# EAGLE design 3level_2NX_interleaved_boost_converter (EAGLE 9.2.2)

## Sheet 1 of 2
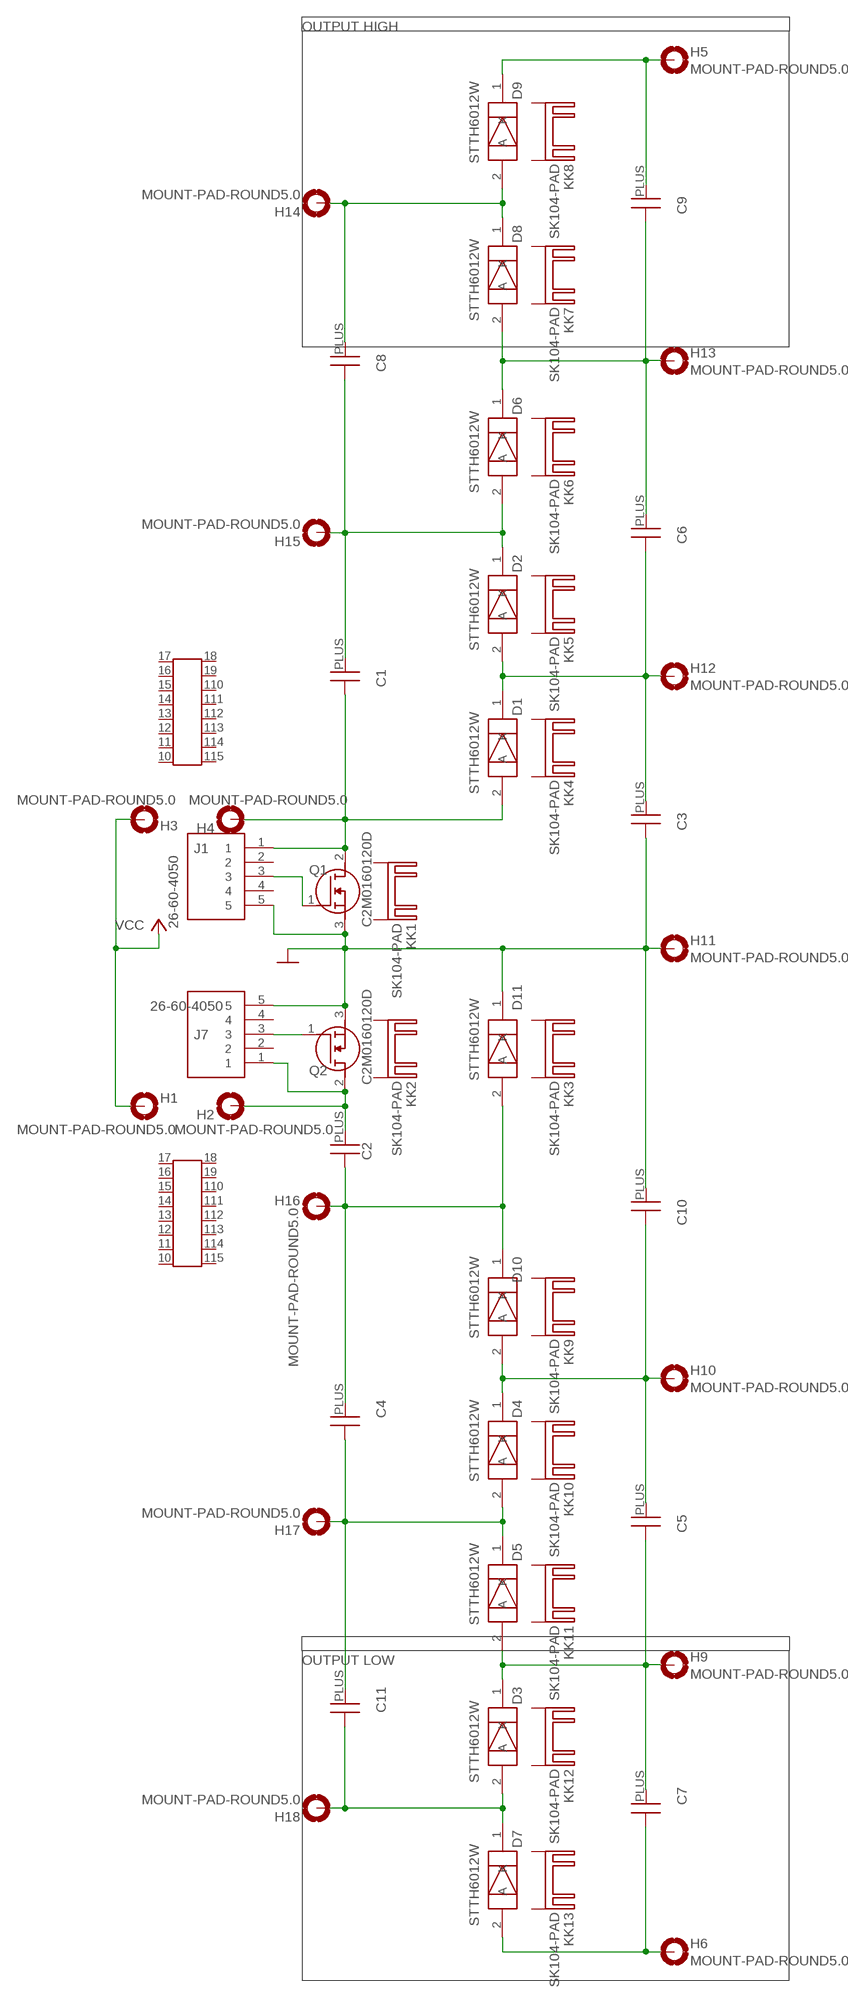
[diagram p0: schematic, sheet 1]

### Parts
C1  SANJEECAP  [ECA2WHG2R2]
C2  SANJEECAP  [ECA2WHG2R2]
C3  SANJEECAP  [ECA2WHG2R2]
C4  SANJEECAP  [ECA2WHG2R2]
C5  SANJEECAP  [ECA2WHG2R2]
C6  SANJEECAP  [ECA2WHG2R2]
C7  SANJEECAP  [ECA2WHG2R2]
C8  SANJEECAP  [ECA2WHG2R2]
C9  SANJEECAP  [ECA2WHG2R2]
C10  SANJEECAP  [ECA2WHG2R2]
C11  SANJEECAP  [ECA2WHG2R2]
D1  STTH6012W  [TO1090P515X1560X2445-2P]
D2  STTH6012W  [TO1090P515X1560X2445-2P]
D3  STTH6012W  [TO1090P515X1560X2445-2P]
D4  STTH6012W  [TO1090P515X1560X2445-2P]
D5  STTH6012W  [TO1090P515X1560X2445-2P]
D6  STTH6012W  [TO1090P515X1560X2445-2P]
D7  STTH6012W  [TO1090P515X1560X2445-2P]
D8  STTH6012W  [TO1090P515X1560X2445-2P]
D9  STTH6012W  [TO1090P515X1560X2445-2P]
D10  STTH6012W  [TO1090P515X1560X2445-2P]
D11  STTH6012W  [TO1090P515X1560X2445-2P]
H1  MOUNT-PAD-ROUND5.0  [5,0-PAD]
H2  MOUNT-PAD-ROUND5.0  [5,0-PAD]
H3  MOUNT-PAD-ROUND5.0  [5,0-PAD]
H4  MOUNT-PAD-ROUND5.0  [5,0-PAD]
H5  MOUNT-PAD-ROUND5.0  [5,0-PAD]
H6  MOUNT-PAD-ROUND5.0  [5,0-PAD]
H9  MOUNT-PAD-ROUND5.0  [5,0-PAD]
H10  MOUNT-PAD-ROUND5.0  [5,0-PAD]
H11  MOUNT-PAD-ROUND5.0  [5,0-PAD]
H12  MOUNT-PAD-ROUND5.0  [5,0-PAD]
H13  MOUNT-PAD-ROUND5.0  [5,0-PAD]
H14  MOUNT-PAD-ROUND5.0  [5,0-PAD]
H15  MOUNT-PAD-ROUND5.0  [5,0-PAD]
H16  MOUNT-PAD-ROUND5.0  [5,0-PAD]
H17  MOUNT-PAD-ROUND5.0  [5,0-PAD]
H18  MOUNT-PAD-ROUND5.0  [5,0-PAD]
J1  26-60-4050  [SHDR5W155P0X396_1X5_1966X1001X]
J7  26-60-4050  [SHDR5W155P0X396_1X5_1966X1001X]
KK1  SK104-PAD  [SK104-PAD]
KK2  SK104-PAD  [SK104-PAD]
KK3  SK104-PAD  [SK104-PAD]
KK4  SK104-PAD  [SK104-PAD]
KK5  SK104-PAD  [SK104-PAD]
KK6  SK104-PAD  [SK104-PAD]
KK7  SK104-PAD  [SK104-PAD]
KK8  SK104-PAD  [SK104-PAD]
KK9  SK104-PAD  [SK104-PAD]
KK10  SK104-PAD  [SK104-PAD]
KK11  SK104-PAD  [SK104-PAD]
KK12  SK104-PAD  [SK104-PAD]
KK13  SK104-PAD  [SK104-PAD]
Q1  C2M0160120D  [TO544P521X1594X2550-3P]
Q2  C2M0160120D  [TO544P521X1594X2550-3P]
U$1  JELL  [BOBBIN]
U$2  JELL  [BOBBIN]

### Nets
GND: C3.MINUS C10.PLUS D11.1(K) H11.B5(MOUNT) J1.5 J7.5 Q1.3(S) Q2.3(S) ; also sheet 2
N$1: C1.PLUS C8.MINUS D2.1(K) D6.2(A) H15.B5(MOUNT)
N$2: C1.MINUS D1.2(A) H4.B5(MOUNT) J1.1 Q1.2(D)
N$3: C3.PLUS C6.MINUS D1.1(K) D2.2(A) H12.B5(MOUNT)
N$4: C8.PLUS D8.1(K) D9.2(A) H14.B5(MOUNT)
N$5: C2.PLUS H2.B5(MOUNT) J7.1 Q2.2(D)
N$6: C9.PLUS D9.1(K) H5.B5(MOUNT)
N$7: C11.MINUS D3.2(A) D7.1(K) H18.B5(MOUNT)
N$8: C7.MINUS D7.2(A) H6.B5(MOUNT)
N$9: C2.MINUS C4.PLUS D10.1(K) D11.2(A) H16.B5(MOUNT)
N$10: C5.PLUS C10.MINUS D4.1(K) D10.2(A) H10.B5(MOUNT)
N$11: C6.PLUS C9.MINUS D6.1(K) D8.2(A) H13.B5(MOUNT)
N$12: J1.3 Q1.1(G)
N$13: J7.3 Q2.1(G)
N$17: C4.MINUS C11.PLUS D4.2(A) D5.1(K) H17.B5(MOUNT)
N$18: C5.MINUS C7.PLUS D3.1(K) D5.2(A) H9.B5(MOUNT)
VCC: H1.B5(MOUNT) H3.B5(MOUNT) ; also sheet 2
Unconnected: J1.2 J1.4 J7.2 J7.4 KK1.K1(K) KK1.K2(K) KK2.K1(K) KK2.K2(K) KK3.K1(K) KK3.K2(K) KK4.K1(K) KK4.K2(K) KK5.K1(K) KK5.K2(K) KK6.K1(K) KK6.K2(K) KK7.K1(K) KK7.K2(K) KK8.K1(K) KK8.K2(K) KK9.K1(K) KK9.K2(K) KK10.K1(K) KK10.K2(K) KK11.K1(K) KK11.K2(K) KK12.K1(K) KK12.K2(K) KK13.K1(K) KK13.K2(K) U$1.10 U$1.11 U$1.12 U$1.13 U$1.14 U$1.15 U$1.16 U$1.17 U$1.18 U$1.19 U$1.110 U$1.111 U$1.112 U$1.113 U$1.114 U$1.115 U$2.10 U$2.11 U$2.12 U$2.13 U$2.14 U$2.15 U$2.16 U$2.17 U$2.18 U$2.19 U$2.110 U$2.111 U$2.112 U$2.113 U$2.114 U$2.115

### Notes on the sheet
- OUTPUT HIGH
- OUTPUT LOW

## Sheet 2 of 2
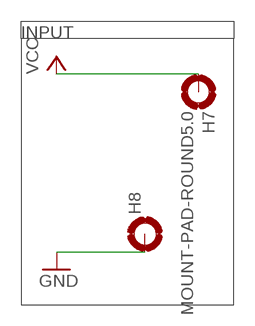
[diagram p1: schematic, sheet 2]

### Parts
H7  MOUNT-PAD-ROUND5.0  [5,0-PAD]
H8  MOUNT-PAD-ROUND5.0  [5,0-PAD]

### Nets
GND: H8.B5(MOUNT) ; also sheet 1
VCC: H7.B5(MOUNT) ; also sheet 1

### Notes on the sheet
- INPUT

## Library data of the parts
C1-C11 = placeholders:SANJEECAP
D1-D11 = SamacSys_Parts:STTH6012W: STTH6012W, Fast Recovery Rectifier Diode, Switching 60A max, 1200V 125ns, 2-Pin, DO-247 Source: Datasheet <http://www.st.com/web/en/resource/technical/document/datasheet/CD00096472.pdf>; ALLIED_NUMBER: 70014108; ALLIED_PRICE-STOCK: http://www.alliedelec.com/stmicroelectronics-stth6012w/70014108/; ARROW_PART_NUMBER: STTH6012W; ARROW_PRICE-STOCK: https://www.arrow.com/en/products/stth6012w/stmicroelectronics; DESCRIPTION: STTH6012W, Fast Recovery Rectifier Diode, Switching 60A max, 1200V 125ns, 2-Pin, DO-247; HEIGHT: 5.15mm; MANUFACTURER_NAME: STMicroelectronics; MANUFACTURER_PART_NUMBER: STTH6012W; RS_PART_NUMBER: 6870818; RS_PRICE-STOCK: http://uk.rs-online.com/web/p/rectifier-schottky-diodes/6870818/?source=DS
H1-H18 = holes:MOUNT-PAD-ROUND: MOUNTING PAD, round
J1 J7 = SamacSys_Parts:26-60-4050: Molex KK 396 Series, Series Number 41791, 3.96mm Pitch 5 Way 1 Row Straight PCB Header, Solder Termination, 7A Source: Datasheet <https://componentsearchengine.com/Datasheets/1/26-60-4050.pdf>; DESCRIPTION: Molex KK 396 Series, Series Number 41791, 3.96mm Pitch 5 Way 1 Row Straight PCB Header, Solder Termination, 7A; HEIGHT: 14.78mm; MANUFACTURER_NAME: Molex; MANUFACTURER_PART_NUMBER: 26-60-4050; MOUSER_PART_NUMBER: 538-26-60-4050
KK1-KK13 = heatsink:SK104-PAD: HEATSINK manufacturer Fischer/distributor Buerklin
Q1 = SamacSys_Parts:C2M0160120D: Wolfspeed C2M0160120D N-channel SiC MOSFET Transistor, 19 A, 1200 V, 3-Pin TO-247 Source: Datasheet <http://www.wolfspeed.com/media/downloads/169/C2M0160120D.pdf>; ARROW_PART_NUMBER: C2M0160120D; ARROW_PRICE-STOCK: http://uk.rs-online.com/web/p/products/1629709; DESCRIPTION: Wolfspeed C2M0160120D N-channel SiC MOSFET Transistor, 19 A, 1200 V, 3-Pin TO-247; HEIGHT: 5.21mm; MANUFACTURER_NAME: Wolfspeed; MANUFACTURER_PART_NUMBER: C2M0160120D; RS_PART_NUMBER: 1629709; RS_PRICE-STOCK: http://uk.rs-online.com/web/p/products/1629709
Q2 = SamacSys_Parts:C2M0160120D: Wolfspeed C2M0160120D N-channel SiC MOSFET Transistor, 19 A, 1200 V, 3-Pin TO-247 Source: Datasheet <http://www.wolfspeed.com/media/downloads/169/C2M0160120D.pdf>; ARROW_PART_NUMBER: C2M0160120D; ARROW_PRICE-STOCK: http://uk.rs-online.com/web/p/products/1629709; DESCRIPTION: Wolfspeed C2M0160120D N-channel SiC MOSFET Transistor, 19 A, 1200 V, 3-Pin TO-247; HEIGHT: 5.21mm; MANUFACTURER_NAME: Wolfspeed; MANUFACTURER_PART_NUMBER: C2M0160120D; RS_PART_NUMBER: 1629709; RS_PRICE-STOCK: http://uk.rs-online.com/web/p/products/1629709; SPICEPREFIX: Q
U$1 U$2 = placeholders:JELL

## Board
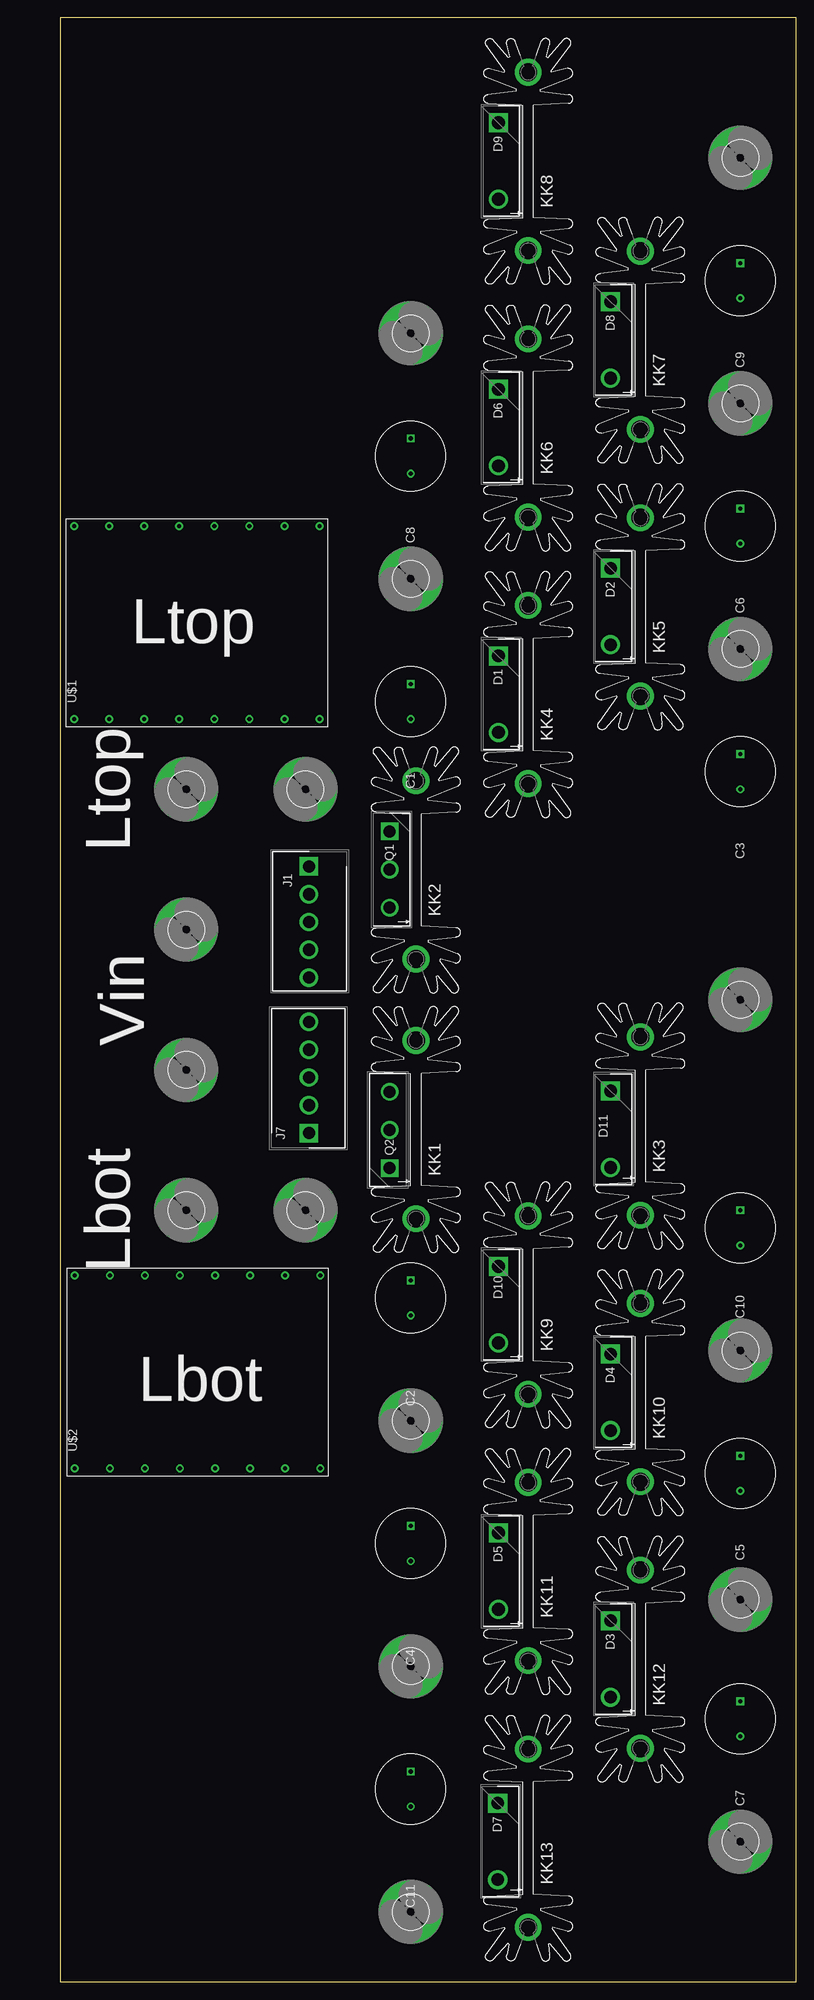
[diagram p2: board, top side]
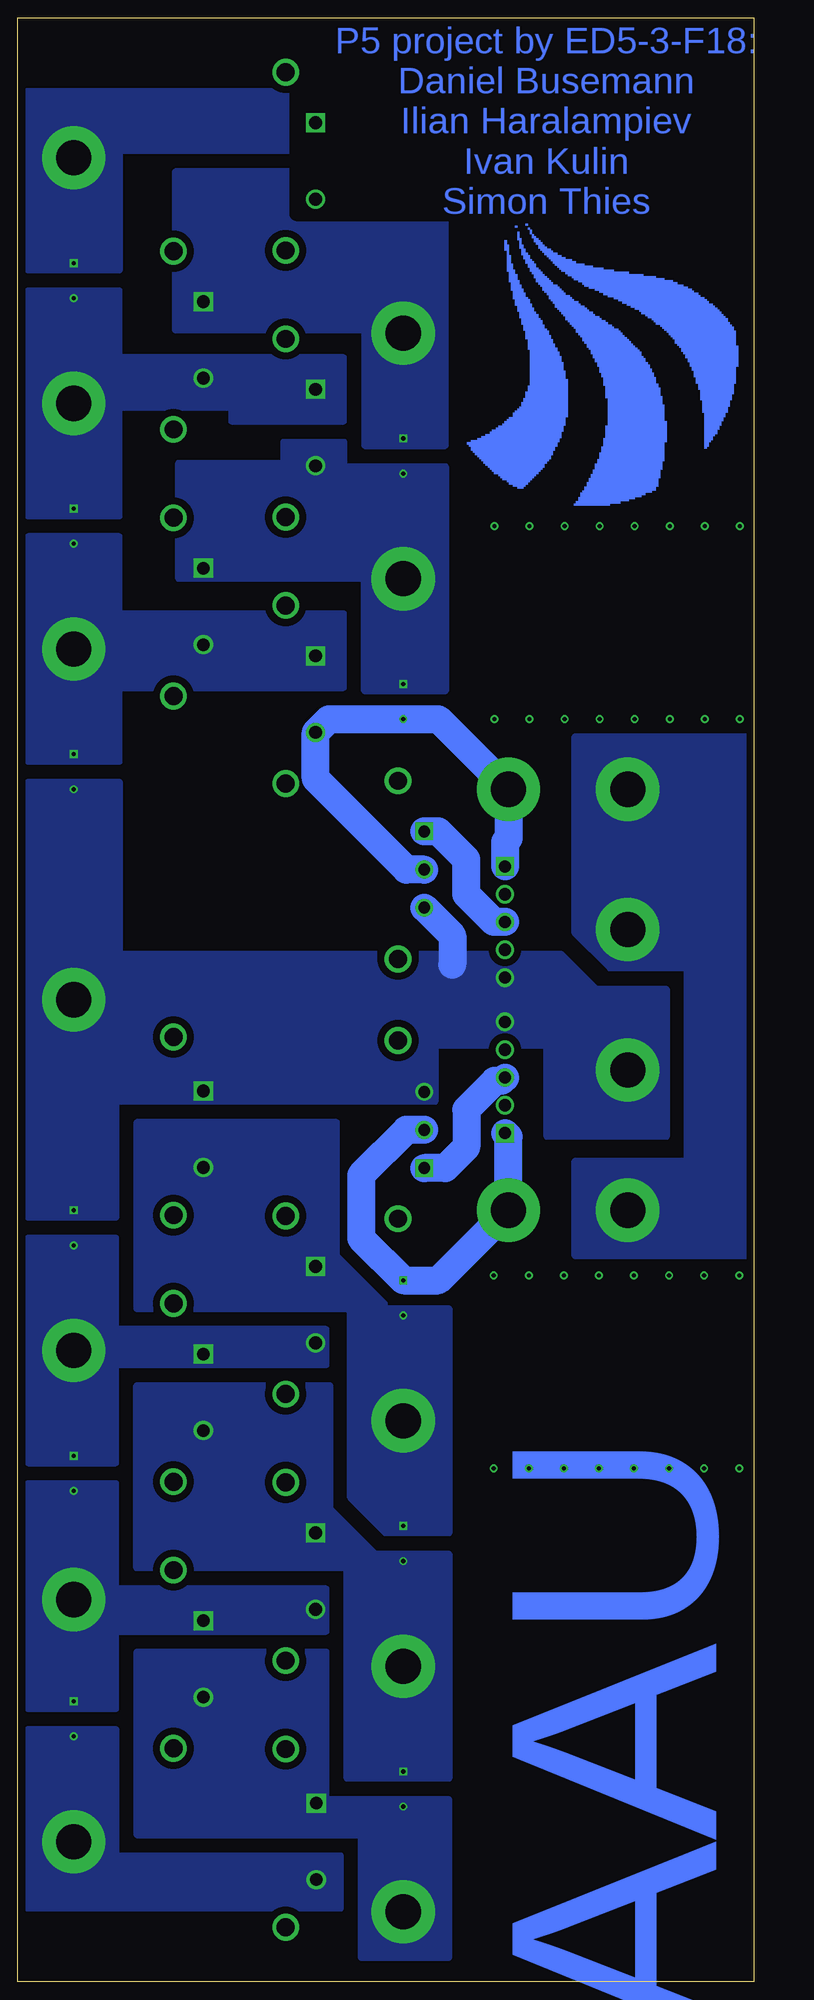
[diagram p3: board, bottom side, seen from below]

Size 105 x 280 mm. Coordinates in mm from the lower left corner, seen from the top.
Outline: 0,0 105,0 105,280 0,280 0,0
Copper layers (1*16): Top 0.035mm / dielectric 1.5mm / Bottom 0.035mm
Design rules "default": minimum track width 6mil, minimum drill 0.35mm, track to track 6mil, track to pad 6mil, pad to pad 6mil, via to via 6mil, smd to smd 6mil, copper to edge 40mil, drill to drill 6mil, minimum pad ring 10mil, minimum via ring 8mil, stop-mask expansion 4mil, vias tented up to drill 0mil, thermal gap 10mil

### Footprints (pad centres in the part's own frame; a part is rotated, then mirrored left to right if it is on the bottom)
ECA2WHG2R2 = drill 0.6: MINUS 5,0 | drill 0.6 pad 1.016 square: PLUS 0,0
TO1090P515X1560X2445-2P = drill 1.81 pad 2.715 square: 1 0,0 | drill 1.81 pad 2.715: 2 10.9,0
5,0-PAD = drill 5 pad 9: B5 0,0
SHDR5W155P0X396_1X5_1966X1001X = drill 1.75 pad 2.625 square: 1 0,0 | drill 1.75 pad 2.625: 2 -3.96,0; 3 -7.92,0; 4 -11.88,0; 5 -15.84,0
SK104-PAD = drill 2.54 pad 3.81: K1 -12.7,-0.762; K2 12.7,-0.762
TO544P521X1594X2550-3P = drill 1.69 pad 2.535 square: 1 0,0 | drill 1.69 pad 2.535: 2 5.44,0; 3 10.88,0
BOBBIN = drill 0.6: 10 0,0; 11 0,-5; 12 0,-10; 13 0,-15; 14 0,-20; 15 0,-25; 16 0,-30; 17 0,-35; 18 27.5,-35; 19 27.5,-30; 110 27.5,-25; 111 27.5,-20; 112 27.5,-15; 113 27.5,-10; 114 27.5,-5; 115 27.5,0

### Placement (x,y rotation side)
C1  50,185 270 top
C2  50,100 270 top
C3  97,175 270 top
C4  50,65 270 top
C5  97,75 270 top
C6  97,210 270 top
C7  97,40 270 top
C8  50,220 270 top
C9  97,245 270 top
C10  97,110 270 top
C11  50,30 270 top
D1  62.5,189 270 top
D2  78.5,201.5 270 top
D3  78.5,51.5 270 top
D4  78.5,89.5 270 top
D5  62.5,64 270 top
D6  62.5,227 270 top
D7  62.4,25.49 270 top
D8  78.5,239.5 270 top
D9  62.5,265 270 top
D10  62.5,102 270 top
D11  78.5,127 270 top
H1  18,150 0 top
H2  35,110 0 top
H3  18,170 0 top
H4  35,170 0 top
H5  97,260 0 top
H6  97,20 0 top
H7  18,110 0 top
H8  18,130 0 top
H9  97,54.5 0 top
H10  97,90 0 top
H11  97,140 0 top
H12  97,190 0 top
H13  97,225 0 top
H14  50,235 0 top
H15  50,200 0 top
H16  50,80 0 top
H17  50,45 0 top
H18  50,10 0 top
J1  35.5,159 90 top
J7  35.5,121 270 top
KK1  50,121.5 90 top
KK2  50,158.5 90 top
KK3  82,122 90 top
KK4  66,183.5 90 top
KK5  82,196 90 top
KK6  66,221.5 90 top
KK7  82,234 90 top
KK8  66,259.5 90 top
KK9  66,96.5 90 top
KK10  82,84 90 top
KK11  66,58.5 90 top
KK12  82,46 90 top
KK13  66,20.5 90 top
Q1  47,164 270 top
Q2  47,116 90 top
U$1  2,180 90 top
U$2  2.1,73.2 90 top

### Tracks (layer width: path | path; a pad name or v marks a point on that pad's centre or on a via)
GND
  Bottom 4: Q1.3 43,149.12 43,145
  pour Bottom (isolate 1, no thermals): 12.5,141.5 12.5,120.5 29.5,120.5 29.5,133.5 45.5,133.5 45.5,125.5 91,125.5 91,109 103.5,109 103.5,171 90.5,171 90.5,146.5 27.5,146.5 22.5,141.5
N$1
  pour Bottom (isolate 1, no thermals): 44,184 55.5,184 55.5,200 82,200 82,216.5 67,216.5 67,219.5 58.5,219.5 58.5,216 44,216
N$2
  Bottom 4: J1.1 35.5,162.5 35,163 H4.B5 45,180 C1.MINUS 60.6,180 D1.2 62.5,171.5 49.56,158.56 Q1.2
N$3
  pour Bottom (isolate 1, no thermals): 90.5,206 103.5,206 103.5,174 90.5,174 90.5,184.5 58.5,184.5 58.5,195 90.5,195
N$4
  pour Bottom (isolate 1, no thermals): 82.5,235.5 55.5,235.5 55.5,219 44,219 44,258 82.5,258
N$5
  Bottom 4: Q2.2 49.56,121.44 56,115 56,106 C2.PLUS 45,100 H2.B5 35,120.5 J7.1
N$6
  pour Bottom (isolate 1, no thermals): 90.5,244 103.5,244 103.5,269.5 58.5,269.5 58.5,261 90.5,261
N$7
  pour Bottom (isolate 1, no thermals): 56,21 56,3.5 43.5,3.5 43.5,26 61,26 61,47 88,47 88,21
N$8
  pour Bottom (isolate 1, no thermals): 59,18 59,10.5 103.5,10.5 103.5,36 91,36 91,18
N$9
  pour Bottom (isolate 1, no thermals): 52.5,96.5 59.5,103.5 59.5,122.5 88,122.5 88,96 58,96 53,91 53,96
  pour Bottom (isolate 1, no thermals): 43.5,64 52.5,64 57.5,69 57.5,96 43.5,96
N$10
  pour Bottom (isolate 1, no thermals): 91,106 103.5,106 103.5,74 91,74 91,88 61,88 61,93 91,93
N$11
  pour Bottom (isolate 1, no thermals): 58.5,222.5 58.5,231.5 90.5,231.5 90.5,241 103.5,241 103.5,209 90.5,209 90.5,224.5 74.5,224.5 74.5,222.5
N$12
  Bottom 4: J1.3 37.08,151.08 41,155 41,160 45,164 Q1.1
N$13
  Bottom 4: J7.3 35.99,128.43 36.94,128.43 41,124.36 41,119 44,116 Q2.1
N$17
  pour Bottom (isolate 1, no thermals): 43.5,29 58,29 58,59 88,59 88,85 60.5,85 60.5,67.5 54,61 43.5,61
N$18
  pour Bottom (isolate 1, no thermals): 91,56 91,71 103.5,71 103.5,39 91,39 91,50 61,50 61,56
VCC
  pour Bottom (isolate 1, no thermals): 9.5,144.5 20.5,144.5 25.5,149.5 25.5,177.5 0.5,177.5 0.5,103.5 25.5,103.5 25.5,117 9.5,117
(copper drawn outside any net)
  shapes: Bottom area x355

### Text on the board
Bottom: P5 project by ED5-3-F18: / Daniel Busemann / Ilian Haralampiev / Ivan Kulin / Simon Thies | AAU
tNames: Ltop | Ltop | Vin | Lbot | Lbot